# Altium schematic sheet pixel_pipelines.SchDoc
size A3; PageSetup: Record=PageOptions|CenterHorizontal=True|CenterVertical=True|PrintScale=0.68|XCorrection=1.00|YCorrection=1.00|PrintKind=1|BorderSize=5000000|LeftOffset=0|BottomOffset=0|Orientation=2|PaperLength=1000|PaperWidth=1000|Scale=100|PaperSource=15|PrintQuality=1200|MediaType=1|DitherType=10|PaperKind=Letter|PrintScaleMode=1
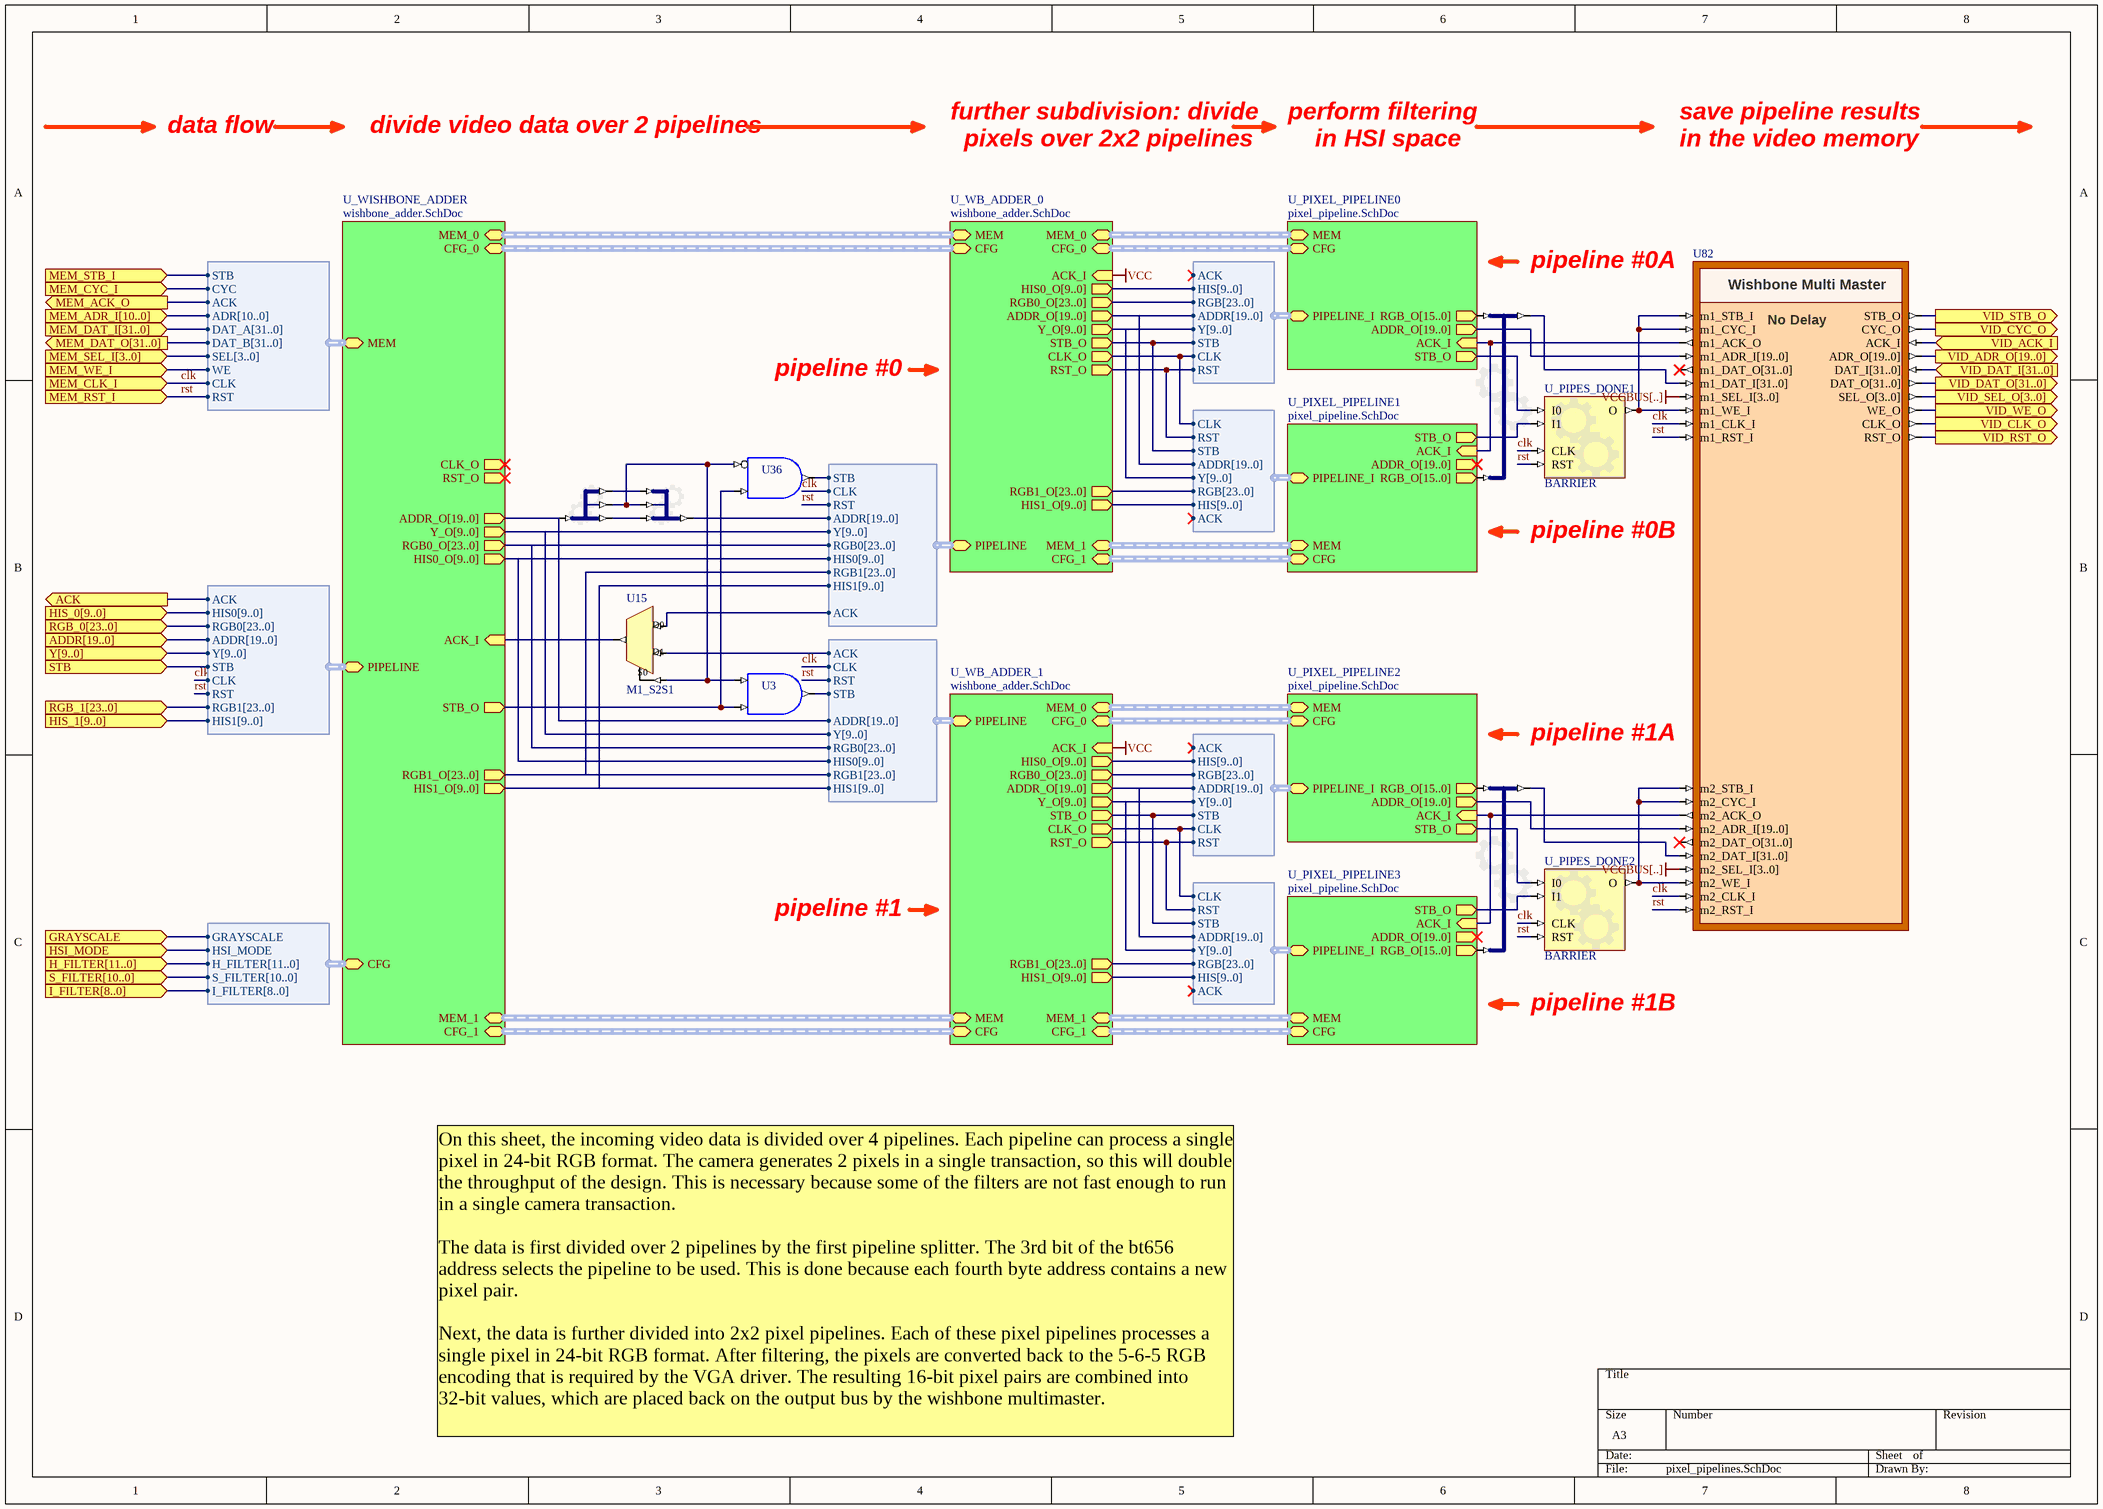
[diagram p0: pixel_pipelines.SchDoc]

## Parts
U3  AND2S  (value not drawn)
U15  M1_S2S1
U18  BUS_JS  (value not drawn)
U19  BUS_JS  (value not drawn)
U34  BUS_JS  (value not drawn)
U36  AND2N1S  (value not drawn)
U75  BUS_JS  (value not drawn)
U82  WB_MULTIMASTER  (value not drawn)
U_PIPES_DONE1  BARRIER
U_PIPES_DONE2  BARRIER

## Sub-sheets
U_PIXEL_PIPELINE0 = pixel_pipeline.SchDoc: RGB_O[15..0] (out), ADDR_O[19..0] (out), STB_O (out), ACK_I (in), PIPELINE_I (harness H_PIXEL_PIPELINE_1_4), MEM (harness WB_A11DAB32S), CFG (harness H_CFG)
U_PIXEL_PIPELINE1 = pixel_pipeline.SchDoc: RGB_O[15..0] (out), ADDR_O[19..0] (out), STB_O (out), ACK_I (in), PIPELINE_I (harness H_PIXEL_PIPELINE_1_4), MEM (harness WB_A11DAB32S), CFG (harness H_CFG)
U_PIXEL_PIPELINE2 = pixel_pipeline.SchDoc: RGB_O[15..0] (out), ADDR_O[19..0] (out), STB_O (out), ACK_I (in), PIPELINE_I (harness H_PIXEL_PIPELINE_1_4), MEM (harness WB_A11DAB32S), CFG (harness H_CFG)
U_PIXEL_PIPELINE3 = pixel_pipeline.SchDoc: RGB_O[15..0] (out), ADDR_O[19..0] (out), STB_O (out), ACK_I (in), PIPELINE_I (harness H_PIXEL_PIPELINE_1_4), MEM (harness WB_A11DAB32S), CFG (harness H_CFG)
U_WB_ADDER_0 = wishbone_adder.SchDoc: MEM_0 (harness WB_A11DAB32S), MEM_1 (harness WB_A11DAB32S), MEM (harness WB_A11DAB32S), CFG_0 (harness H_CFG), CFG_1 (harness H_CFG), CFG (harness H_CFG), PIPELINE (harness H_PIXEL_PIPELINE_2_6), ACK_I (in), HIS0_O[9..0] (out), RGB0_O[23..0] (out), ADDR_O[19..0] (out), Y_O[9..0] (out), STB_O (out), CLK_O (out), RST_O (out), RGB1_O[23..0] (out), HIS1_O[9..0] (out)
U_WB_ADDER_1 = wishbone_adder.SchDoc: MEM_0 (harness WB_A11DAB32S), MEM_1 (harness WB_A11DAB32S), MEM (harness WB_A11DAB32S), CFG_0 (harness H_CFG), CFG_1 (harness H_CFG), CFG (harness H_CFG), PIPELINE (harness H_PIXEL_PIPELINE_2_6), ACK_I (in), HIS0_O[9..0] (out), RGB0_O[23..0] (out), ADDR_O[19..0] (out), Y_O[9..0] (out), STB_O (out), CLK_O (out), RST_O (out), RGB1_O[23..0] (out), HIS1_O[9..0] (out)
U_WISHBONE_ADDER = wishbone_adder.SchDoc: MEM_0 (harness WB_A11DAB32S), MEM_1 (harness WB_A11DAB32S), MEM (harness WB_A11DAB32S), CFG_0 (harness H_CFG), CFG_1 (harness H_CFG), CFG (harness H_CFG), PIPELINE (harness H_PIXEL_PIPELINE_2_6), ACK_I (in), HIS0_O[9..0] (out), RGB0_O[23..0] (out), ADDR_O[19..0] (out), Y_O[9..0] (out), STB_O (out), RGB1_O[23..0] (out), HIS1_O[9..0] (out), CLK_O (out), RST_O (out)

## Ports
ACK (out), ADDR[19..0] (in), GRAYSCALE (in), H_FILTER[11..0] (in), HIS_0[9..0] (in), HIS_1[9..0] (in), HSI_MODE (in), I_FILTER[8..0] (in), MEM_ACK_O (out), MEM_ADR_I[10..0] (in), MEM_CLK_I (in), MEM_CYC_I (in), MEM_DAT_I[31..0] (in), MEM_DAT_O[31..0] (out), MEM_RST_I (in), MEM_SEL_I[3..0] (in), MEM_STB_I (in), MEM_WE_I (in), RGB_0[23..0] (in), RGB_1[23..0] (in), S_FILTER[10..0] (in), STB (in), VID_ACK_I (in), VID_ADR_O[19..0] (out), VID_CLK_O (out), VID_CYC_O (out), VID_DAT_I[31..0] (in), VID_DAT_O[31..0] (out), VID_RST_O (out), VID_SEL_O[3..0] (out), VID_STB_O (out), VID_WE_O (out), Y[9..0] (in)

## Harnesses
H_PIXEL_PIPELINE_2_6: HIS0[9..0], RGB0[23..0], ADDR[19..0], Y[9..0], RGB1[23..0], HIS1[9..0], STB, ACK, RST, CLK
H_PIXEL_PIPELINE_2_6: HIS0[9..0], RGB0[23..0], ADDR[19..0], Y[9..0], RGB1[23..0], HIS1[9..0], STB, ACK, CLK, RST
WB_A11DAB32S: WE, DAT_B[31..0], CLK, RST, SEL[3..0], DAT_A[31..0], ADR[10..0], CYC, STB, ACK
H_PIXEL_PIPELINE_2_6: ACK, HIS0[9..0], RGB0[23..0], ADDR[19..0], Y[9..0], STB, RGB1[23..0], HIS1[9..0], CLK, RST
H_PIXEL_PIPELINE_1_4: ADDR[19..0], RGB[23..0], Y[9..0], HIS[9..0], STB, CLK, RST, ACK
H_CFG: GRAYSCALE, S_FILTER[10..0], HSI_MODE, I_FILTER[8..0], H_FILTER[11..0]

## Nets
VCC: sheet U_WB_ADDER_0/ACK_I, sheet U_WB_ADDER_1/ACK_I
VCCBUS[..]: U82.m1_SEL_I[3..0] U82.m2_SEL_I[3..0]
ACK: port ACK, sheet U_WISHBONE_ADDER/PIPELINE.ACK
clk: U82.m1_CLK_I U82.m2_CLK_I U_PIPES_DONE1.CLK U_PIPES_DONE2.CLK ; port MEM_CLK_I, sheet U_WB_ADDER_1/PIPELINE.CLK, sheet U_WB_ADDER_0/PIPELINE.CLK, sheet U_WISHBONE_ADDER/MEM.CLK, sheet U_WISHBONE_ADDER/PIPELINE.CLK
GRAYSCALE: port GRAYSCALE, sheet U_WISHBONE_ADDER/CFG.GRAYSCALE
HSI_MODE: port HSI_MODE, sheet U_WISHBONE_ADDER/CFG.HSI_MODE
MEM_ACK_O: port MEM_ACK_O, sheet U_WISHBONE_ADDER/MEM.ACK
MEM_CYC_I: port MEM_CYC_I, sheet U_WISHBONE_ADDER/MEM.CYC
MEM_STB_I: port MEM_STB_I, sheet U_WISHBONE_ADDER/MEM.STB
MEM_WE_I: port MEM_WE_I, sheet U_WISHBONE_ADDER/MEM.WE
rst: U82.m1_RST_I U82.m2_RST_I U_PIPES_DONE1.RST U_PIPES_DONE2.RST ; port MEM_RST_I, sheet U_WB_ADDER_1/PIPELINE.RST, sheet U_WB_ADDER_0/PIPELINE.RST, sheet U_WISHBONE_ADDER/MEM.RST, sheet U_WISHBONE_ADDER/PIPELINE.RST
STB: port STB, sheet U_WISHBONE_ADDER/PIPELINE.STB
VID_ACK_I: U82.ACK_I ; port VID_ACK_I
VID_ADR_O[19..0]: U82.ADR_O[19..0] ; port VID_ADR_O[19..0]
VID_CLK_O: U82.CLK_O ; port VID_CLK_O
VID_CYC_O: U82.CYC_O ; port VID_CYC_O
VID_DAT_I[31..0]: U82.DAT_I[31..0] ; port VID_DAT_I[31..0]
VID_DAT_O[31..0]: U82.DAT_O[31..0] ; port VID_DAT_O[31..0]
VID_RST_O: U82.RST_O ; port VID_RST_O
VID_SEL_O[3..0]: U82.SEL_O[3..0] ; port VID_SEL_O[3..0]
VID_STB_O: U82.STB_O ; port VID_STB_O
VID_WE_O: U82.WE_O ; port VID_WE_O
NetU3_I0: U3.I0 U15.S0 U34.I1 U36.I0 U75.O1
NetU3_I1: U3.I1 U36.I1 ; sheet U_WISHBONE_ADDER/STB_O
NetU3_O: U3.O ; sheet U_WB_ADDER_1/PIPELINE.STB
NetU15_D0: U15.D0 ; sheet U_WB_ADDER_0/PIPELINE.ACK
NetU15_D1: U15.D1 ; sheet U_WB_ADDER_1/PIPELINE.ACK
NetU15_O: U15.O ; sheet U_WISHBONE_ADDER/ACK_I
NetU18_I0_B[15..0]: U18.I0_B[15..0] ; sheet U_PIXEL_PIPELINE0/RGB_O[15..0]
NetU18_I1_B[15..0]: U18.I1_B[15..0] ; sheet U_PIXEL_PIPELINE1/RGB_O[15..0]
NetU18_O[31..0]: U18.O[31..0] U82.m1_DAT_I[31..0]
NetU19_I0_B[15..0]: U19.I0_B[15..0] ; sheet U_PIXEL_PIPELINE2/RGB_O[15..0]
NetU19_I1_B[15..0]: U19.I1_B[15..0] ; sheet U_PIXEL_PIPELINE3/RGB_O[15..0]
NetU19_O[31..0]: U19.O[31..0] U82.m2_DAT_I[31..0]
NetU34_I0_B[1..0]: U34.I0_B[1..0] U75.O0_B[1..0]
NetU34_I2_B[16..0]: U34.I2_B[16..0] U75.O2_B[16..0]
NetU34_O[19..0]: U34.O[19..0] ; sheet U_WB_ADDER_0/PIPELINE.ADDR[19..0]
NetU36_O: U36.O ; sheet U_WB_ADDER_0/PIPELINE.STB
NetU75_I[19..0]: U75.I[19..0] ; sheet U_WISHBONE_ADDER/ADDR_O[19..0], sheet U_WB_ADDER_1/PIPELINE.ADDR[19..0]
NetU82_m1_ACK_O: U82.m1_ACK_O ; sheet U_PIXEL_PIPELINE0/ACK_I, sheet U_PIXEL_PIPELINE1/ACK_I
NetU82_m1_ADR_I[19..0]: U82.m1_ADR_I[19..0] ; sheet U_PIXEL_PIPELINE0/ADDR_O[19..0]
NetU82_m1_CYC_I: U82.m1_CYC_I U82.m1_STB_I U82.m1_WE_I U_PIPES_DONE1.O
NetU82_m2_ACK_O: U82.m2_ACK_O ; sheet U_PIXEL_PIPELINE2/ACK_I, sheet U_PIXEL_PIPELINE3/ACK_I
NetU82_m2_ADR_I[19..0]: U82.m2_ADR_I[19..0] ; sheet U_PIXEL_PIPELINE2/ADDR_O[19..0]
NetU82_m2_CYC_I: U82.m2_CYC_I U82.m2_STB_I U82.m2_WE_I U_PIPES_DONE2.O
NetU_PIPES_DONE1_I0: U_PIPES_DONE1.I0 ; sheet U_PIXEL_PIPELINE0/STB_O
NetU_PIPES_DONE1_I1: U_PIPES_DONE1.I1 ; sheet U_PIXEL_PIPELINE1/STB_O
NetU_PIPES_DONE2_I0: U_PIPES_DONE2.I0 ; sheet U_PIXEL_PIPELINE2/STB_O
NetU_PIPES_DONE2_I1: U_PIPES_DONE2.I1 ; sheet U_PIXEL_PIPELINE3/STB_O
(unnamed): sheet U_WB_ADDER_0/STB_O, sheet U_PIXEL_PIPELINE0/PIPELINE_I.STB, sheet U_PIXEL_PIPELINE1/PIPELINE_I.STB
(unnamed): sheet U_WB_ADDER_0/CLK_O, sheet U_PIXEL_PIPELINE0/PIPELINE_I.CLK, sheet U_PIXEL_PIPELINE1/PIPELINE_I.CLK
(unnamed): sheet U_WB_ADDER_0/RST_O, sheet U_PIXEL_PIPELINE0/PIPELINE_I.RST, sheet U_PIXEL_PIPELINE1/PIPELINE_I.RST
(unnamed): sheet U_WB_ADDER_1/STB_O, sheet U_PIXEL_PIPELINE2/PIPELINE_I.STB, sheet U_PIXEL_PIPELINE3/PIPELINE_I.STB
(unnamed): sheet U_WB_ADDER_1/CLK_O, sheet U_PIXEL_PIPELINE2/PIPELINE_I.CLK, sheet U_PIXEL_PIPELINE3/PIPELINE_I.CLK
(unnamed): sheet U_WB_ADDER_1/RST_O, sheet U_PIXEL_PIPELINE2/PIPELINE_I.RST, sheet U_PIXEL_PIPELINE3/PIPELINE_I.RST

Not connected (* = marked no-connect by the designer): U82 m1_DAT_O[31..0]* m2_DAT_O[31..0]*

## Buses and harness runs
harness sheet U_PIXEL_PIPELINE0/CFG = sheet U_WB_ADDER_0/CFG_0
harness sheet U_PIXEL_PIPELINE0/MEM = sheet U_WB_ADDER_0/MEM_0
harness sheet U_PIXEL_PIPELINE1/CFG = sheet U_WB_ADDER_0/CFG_1
harness sheet U_PIXEL_PIPELINE1/MEM = sheet U_WB_ADDER_0/MEM_1
harness sheet U_PIXEL_PIPELINE2/CFG = sheet U_WB_ADDER_1/CFG_0
harness sheet U_PIXEL_PIPELINE2/MEM = sheet U_WB_ADDER_1/MEM_0
harness sheet U_PIXEL_PIPELINE3/CFG = sheet U_WB_ADDER_1/CFG_1
harness sheet U_PIXEL_PIPELINE3/MEM = sheet U_WB_ADDER_1/MEM_1
harness sheet U_WB_ADDER_0/CFG = sheet U_WISHBONE_ADDER/CFG_0
harness sheet U_WB_ADDER_0/MEM = sheet U_WISHBONE_ADDER/MEM_0
harness sheet U_WB_ADDER_1/CFG = sheet U_WISHBONE_ADDER/CFG_1
harness sheet U_WB_ADDER_1/MEM = sheet U_WISHBONE_ADDER/MEM_1

## Notes on the sheet
- data flow
- divide video data over 2 pipelines
- further subdivision: divide
- pixels over 2x2 pipelines
- perform filtering
- in HSI space
- save pipeline results
- in the video memory
- pipeline #0A
- pipeline #0
- (near U82) pipeline #0B
- (near U82) pipeline #1A
- pipeline #1
- pipeline #1B
- On this sheet, the incoming video data is divided over 4 pipelines. Each pipeline can process a single pixel in 24-bit RGB format. The camera generates 2 pixels in a single transaction, so this will double the throughput of the design. This is necessary because some of the filters are not fast enough to run in a single camera transaction.
  The data is first divided over 2 pipelines by the first pipeline splitter. The 3rd bit of the bt656 address selects the pipeline to be used. This is done because each fourth byte address contains a new pixel pair.
  Next, the data is further divided into 2x2 pixel pipelines. Each of these pixel pipelines processes a single pixel in 24-bit RGB format. After filtering, the pixels are converted back to the 5-6-5 RGB encoding that is required by the VGA driver. The resulting 16-bit pixel pairs are combined into 32-bit values, which are placed back on the output bus by the wishbone multimaster.
- (in symbol WB_MULTIMASTER) Wishbone Multi Master; No Delay

## Library data of the parts
U3 = AND2S: 2-Input AND Gate, Single Pin Version; XilinxEquivalent: AND2; FunctionalClass: Logic Primitive; PortSize: 2; ArchiveName: GENERIC; VHDLIB_SIM: GENERIC_LIB; Published: 29-Jan-2004; Publisher: Altium Limited; LastRevisionNo: 1.00.00; HelpURL: CR0118 FPGA Generic Library Guide.pdf#page=114; ComponentLink1URL: CR0136 FPGA Logic Primitive Resource Usage.pdf#page=13; ComponentLink1Description: Core &Resource Usage; SubClass: AND; PortStyle: Single Pin Version
U15 = M1_S2S1: 2x1-Single Wire to 1x1-Single Wire Multiplexer; XilinxEquivalent: M2_1; SubClass: SnS1; PortSize: 1; PortStyle: Single Pin Version; ArchiveName: GENERIC; VHDLIB_SIM: GENERIC_LIB; Published: 29-Jan-2004; Publisher: Altium Limited; LastRevisionNo: 1.00.00; HelpURL: CR0118 FPGA Generic Library Guide.pdf#page=364; ComponentLink1URL: CR0137 FPGA Multiplexer Resource Usage.pdf#page=50; ComponentLink1Description: Core &Resource Usage; FunctionalClass: Multiplexer
U18 U19 = BUS_JS: Configurable Bus Joiner/Splitter; ConfiguratorName: GENERIC_BUS_JS; ConfigurationParameters: {}Version[1.1]{}SplitterJoinerType[Joiner]{}SignalCount[2]{}SignalWidth0[16]{}GapBelow0[12000000]{}ConnectionType0[Pin]{}SignalWidth1[16]{}GapBelow1[1000000]{}ConnectionType1[Pin]{}ShowPinNames[False]{}; LastRevisionNo: 1.00.00; Published: 17-Sep-2008; Publisher: Altium Limited; HelpURL: https://wiki.altium.com/display/ADOH/Configurable+Generic+Library
U34 = BUS_JS: Configurable Bus Joiner/Splitter; ConfiguratorName: GENERIC_BUS_JS; ConfigurationParameters: {}Version[1.1]{}SplitterJoinerType[Joiner]{}SignalCount[3]{}SignalWidth0[2]{}GapBelow0[1000000]{}ConnectionType0[Pin]{}SignalWidth1[1]{}GapBelow1[1000000]{}ConnectionType1[Pin]{}SignalWidth2[17]{}GapBelow2[1000000]{}ConnectionType2[Pin]{}ShowPinNames[False]{}; LastRevisionNo: 1.00.00; Published: 17-Sep-2008; Publisher: Altium Limited
U36 = AND2N1S: 2-Input AND Gate with Active Low A Input, Single Pin Version; XilinxEquivalent: AND2B1; FunctionalClass: Logic Primitive; PortSize: 2; ArchiveName: GENERIC; VHDLIB_SIM: GENERIC_LIB; Published: 29-Jan-2004; Publisher: Altium Limited; LastRevisionNo: 1.00.00; HelpURL: CR0118 FPGA Generic Library Guide.pdf#page=114; ComponentLink1URL: CR0136 FPGA Logic Primitive Resource Usage.pdf#page=10; ComponentLink1Description: Core &Resource Usage; SubClass: AND; PortStyle: Single Pin Version
U75 = BUS_JS: Configurable Bus Joiner/Splitter; ConfiguratorName: GENERIC_BUS_JS; ConfigurationParameters: {}Version[1.1]{}SplitterJoinerType[Splitter]{}SignalCount[3]{}SignalWidth0[2]{}GapBelow0[1000000]{}ConnectionType0[Pin]{}SignalWidth1[1]{}GapBelow1[1000000]{}ConnectionType1[Pin]{}SignalWidth2[17]{}GapBelow2[1000000]{}ConnectionType2[Pin]{}ShowPinNames[False]{}; LastRevisionNo: 1.00.00; Published: 17-Sep-2008; Publisher: Altium Limited
U82 = WB_MULTIMASTER: Configurable Wishbone Multi Master; ConfigurationParameters: {}Version[1.0]{}DataWidth[0]{}AddressWidth[20]{}SpaceAfter[26,0]{}DualType[0]{}MasterNames[m1,m2]{}PriorityDevice[1,2]{}Masters[2]{}ZeroDelay[m1]{}Interrupts[False]; ComponentLink1Description: Core &Resource Usage; ComponentLink1URL: CR0139 FPGA Peripheral Resource Usage.pdf#page=96; HelpURL: CR0168 WB_MULTIMASTER Configurable Wishbone Multi-Master.pdf; LastRevisionNo: 1.00.00; Published: 27-Mar-2005; Publisher: Altium Limited; ConfiguratorName: WB_MULTIMASTER
U_PIPES_DONE1 U_PIPES_DONE2 = BARRIER: Configurable Barrier; ConfiguratorName: GENERIC_BARRIER; ConfigurationParameters: {}Version[1.0]{}Option_BusInput[False]{}Option_BarrierOutputType[Normal]{}Option_RegisterOutputs[False]{}Option_NegativeClockEdge[False]{}Option_InputCount[2]{}InputInvert0[False]{}InputInvert1[False]{}; HelpURL: https://wiki.altium.com/display/ADOH/Configurable+Generic+Library; LastRevisionNo: 1.00.00; Published: 29-Apr-2010; Publisher: Altium Limited